# Altium schematic sheet SOM_POWER.SchDoc
size 420 x 297 mm; SheetNumber: 7; SheetTotal: 19
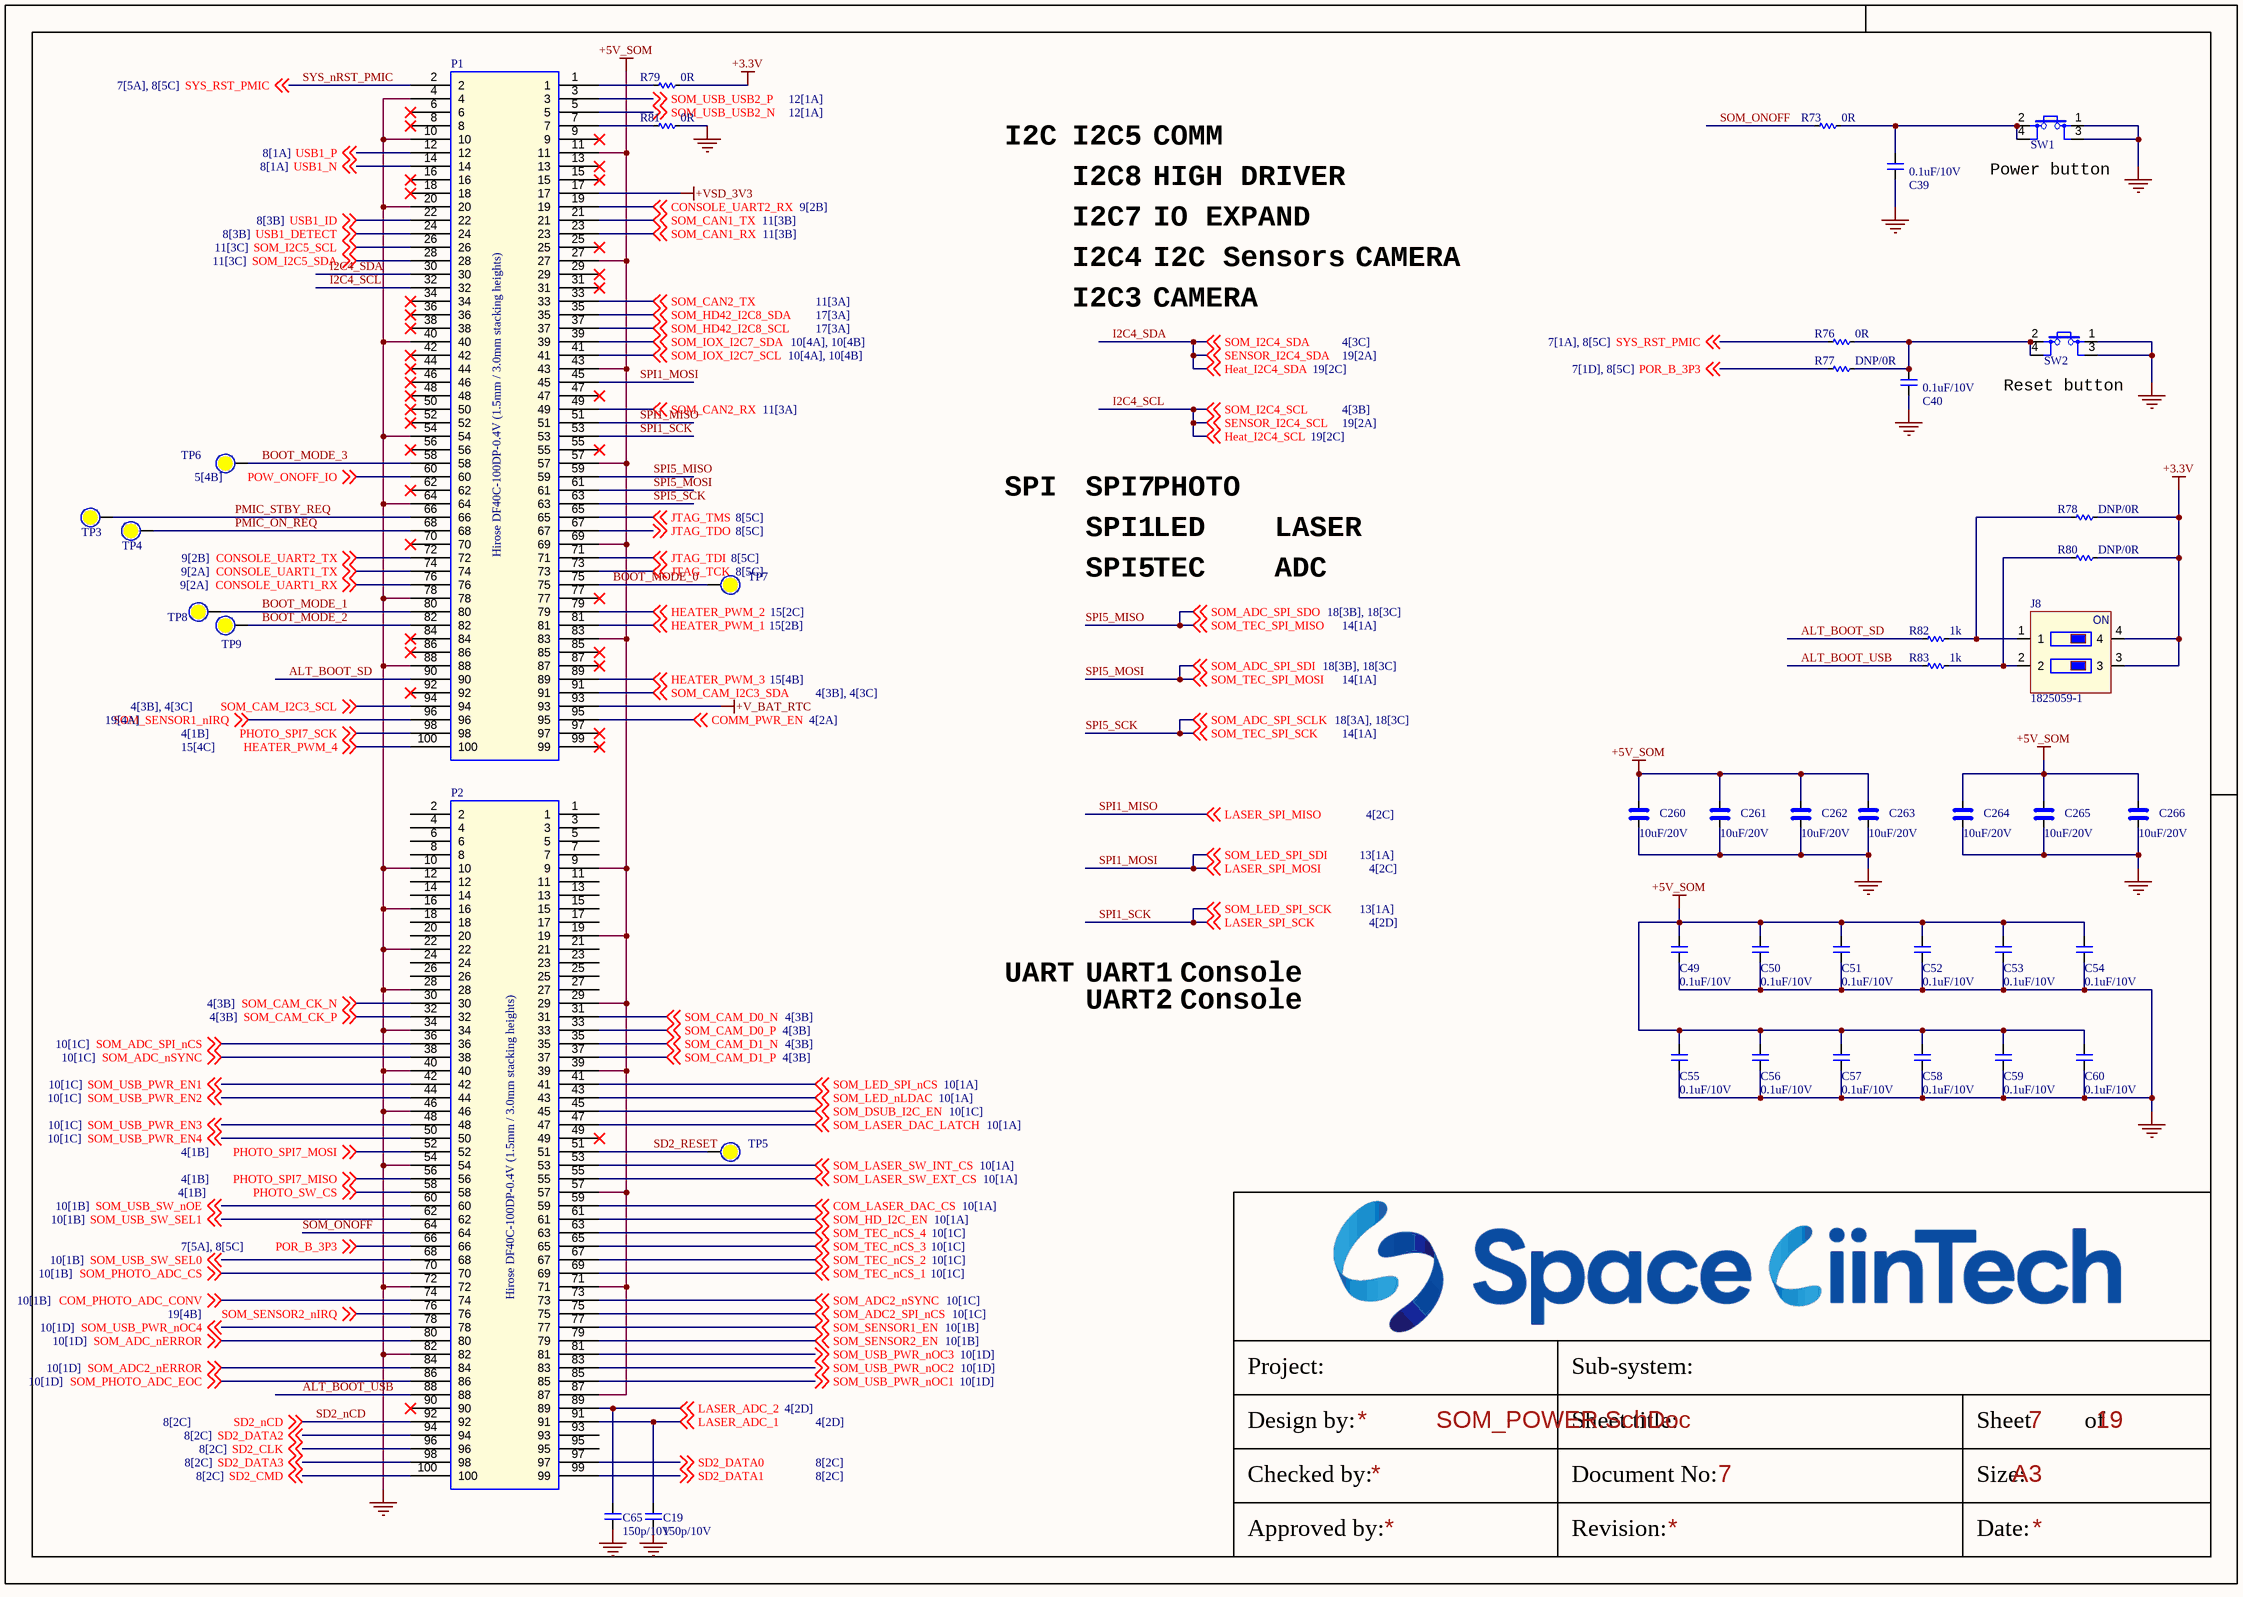
[diagram p0: SOM_POWER.SchDoc]

## Parts
C19  150p/10V  [CAP_C_1005X60]
C39  0.1uF/10V  [CAP_C_1005X60]
C40  0.1uF/10V  [CAP_C_1005X60]
C49  0.1uF/10V  [CAP_C_1005X60]
C50  0.1uF/10V  [CAP_C_1005X60]
C51  0.1uF/10V  [CAP_C_1005X60]
C52  0.1uF/10V  [CAP_C_1005X60]
C53  0.1uF/10V  [CAP_C_1005X60]
C54  0.1uF/10V  [CAP_C_1005X60]
C55  0.1uF/10V  [CAP_C_1005X60]
C56  0.1uF/10V  [CAP_C_1005X60]
C57  0.1uF/10V  [CAP_C_1005X60]
C58  0.1uF/10V  [CAP_C_1005X60]
C59  0.1uF/10V  [CAP_C_1005X60]
C60  0.1uF/10V  [CAP_C_1005X60]
C65  150p/10V  [CAP_C_1005X60]
C260  10uF/20V  [CAP_C_2012X110]
C261  10uF/20V  [CAP_C_2012X110]
C262  10uF/20V  [CAP_C_2012X110]
C263  10uF/20V  [CAP_C_2012X110]
C264  10uF/20V  [CAP_C_2012X110]
C265  10uF/20V  [CAP_C_2012X110]
C266  10uF/20V  [CAP_C_2012X110]
J8  1825059-1  [SW_1825059-1]
P1  Hirose DF40C-100DP-0.4V (1.5mm / 3.0mm stacking heights)  [B2B04M2X50R]
P2  Hirose DF40C-100DP-0.4V (1.5mm / 3.0mm stacking heights)  [B2B04M2X50R]
R73  0R  [RES_C_1005X40]
R76  0R  [RES_C_1005X40]
R77  DNP/0R  [RES_C_1005X40]
R78  DNP/0R  [RES_C_1005X40]
R79  0R  [RES_C_1005X40]
R80  DNP/0R  [RES_C_1005X40]
R81  0R  [RES_C_1005X40]
R82  1k  [RES_C_1005X40]
R83  1k  [RES_C_1005X40]
SW1  PushB  [TACTSW6x6SM]  (value not drawn)
SW2  PushB  [TACTSW6x6SM]  (value not drawn)
TP3  (no value)  [Testpoint_TH_D130H80]  (no BOM)
TP4  (no value)  [Testpoint_TH_D130H80]  (no BOM)
TP5  (no value)  [Testpoint_TH_D130H80]  (no BOM)
TP6  (no value)  [Testpoint_TH_D130H80]  (no BOM)
TP7  (no value)  [Testpoint_TH_D130H80]  (no BOM)
TP8  (no value)  [Testpoint_TH_D130H80]  (no BOM)
TP9  (no value)  [Testpoint_TH_D130H80]  (no BOM)

## Nets
+3.3V: J8.3 J8.4 R78.1 R79.1 R80.1
+5V_SOM: C49.2 C50.2 C51.2 C52.2 C53.2 C54.2 C55.2 C56.2 C57.2 C58.2 C59.2 C60.2 C260.1 C261.1 C262.1 C263.1 C264.1 C265.1 C266.1 P1.11 P1.27 P1.43 P1.57 P1.69 P1.83 P2.9 P2.19 P2.29 P2.39 P2.57 P2.71 P2.87
+V_BAT_RTC: P1.93
+VSD_3V3: P1.17
GND: C19.2 C39.1 C40.1 C49.1 C50.1 C51.1 C52.1 C53.1 C54.1 C55.1 C56.1 C57.1 C58.1 C59.1 C60.1 C65.2 C260.2 C261.2 C262.2 C263.2 C264.2 C265.2 C266.2 P1.4 P1.10 P1.20 P1.40 P1.54 P1.64 P1.78 P1.88 P2.10 P2.16 P2.22 P2.28 P2.34 P2.40 P2.46 P2.54 P2.72 P2.82 R81.1 SW1.1 SW1.3 SW2.1 SW2.3
ALT_BOOT_SD: P1.90 R82.2
ALT_BOOT_USB: P2.88 R83.2
BOOT_MODE_0: P1.75 TP7.0
BOOT_MODE_1: P1.80 TP8.0
BOOT_MODE_2: P1.82 TP9.0
BOOT_MODE_3: P1.58 TP6.0
COM_LASER_DAC_CS: P2.59 ; off-sheet COM_LASER_DAC_CS
COM_PHOTO_ADC_CONV: P2.74 ; off-sheet COM_PHOTO_ADC_CONV
COMM_PWR_EN: P1.95 ; off-sheet COMM_PWR_EN
CONSOLE_UART1_RX: P1.76 ; off-sheet CONSOLE_UART1_RX
CONSOLE_UART1_TX: P1.74 ; off-sheet CONSOLE_UART1_TX
CONSOLE_UART2_RX: P1.19 ; off-sheet CONSOLE_UART2_RX
CONSOLE_UART2_TX: P1.72 ; off-sheet CONSOLE_UART2_TX
HEATER_PWM_1: P1.81 ; off-sheet HEATER_PWM_1
HEATER_PWM_2: P1.79 ; off-sheet HEATER_PWM_2
HEATER_PWM_3: P1.89 ; off-sheet HEATER_PWM_3
HEATER_PWM_4: P1.100 ; off-sheet HEATER_PWM_4
I2C4_SCL: P1.32 ; off-sheet SOM_I2C4_SCL, off-sheet SENSOR_I2C4_SCL, off-sheet Heat_I2C4_SCL  [also labelled Heat_I2C4_SCL, SENSOR_I2C4_SCL, SOM_I2C4_SCL]
I2C4_SDA: P1.30 ; off-sheet SOM_I2C4_SDA, off-sheet SENSOR_I2C4_SDA, off-sheet Heat_I2C4_SDA  [also labelled Heat_I2C4_SDA, SENSOR_I2C4_SDA, SOM_I2C4_SDA]
JTAG_TCK: P1.73 ; off-sheet JTAG_TCK
JTAG_TDI: P1.71 ; off-sheet JTAG_TDI
JTAG_TDO: P1.67 ; off-sheet JTAG_TDO
JTAG_TMS: P1.65 ; off-sheet JTAG_TMS
LASER_ADC_1: C19.1 P2.91 ; off-sheet LASER_ADC_1
LASER_ADC_2: C65.1 P2.89 ; off-sheet LASER_ADC_2
PHOTO_SPI7_MISO: P2.56 ; off-sheet PHOTO_SPI7_MISO
PHOTO_SPI7_MOSI: P2.52 ; off-sheet PHOTO_SPI7_MOSI
PHOTO_SPI7_SCK: P1.98 ; off-sheet PHOTO_SPI7_SCK
PHOTO_SW_CS: P2.58 ; off-sheet PHOTO_SW_CS
PMIC_ON_REQ: P1.68 TP4.0
PMIC_STBY_REQ: P1.66 TP3.0
POR_B_3P3: P2.66 R77.2 ; off-sheet POR_B_3P3
POW_ONOFF_IO: P1.60 ; off-sheet POW_ONOFF_IO
SD2_CLK: P2.96 ; off-sheet SD2_CLK
SD2_CMD: P2.100 ; off-sheet SD2_CMD
SD2_DATA0: P2.97 ; off-sheet SD2_DATA0
SD2_DATA1: P2.99 ; off-sheet SD2_DATA1
SD2_DATA2: P2.94 ; off-sheet SD2_DATA2
SD2_DATA3: P2.98 ; off-sheet SD2_DATA3
SD2_nCD: P2.92 ; off-sheet SD2_nCD
SD2_RESET: P2.51 TP5.0
SOM_ADC2_nERROR: P2.84 ; off-sheet SOM_ADC2_nERROR
SOM_ADC2_nSYNC: P2.73 ; off-sheet SOM_ADC2_nSYNC
SOM_ADC2_SPI_nCS: P2.75 ; off-sheet SOM_ADC2_SPI_nCS
SOM_ADC_nERROR: P2.80 ; off-sheet SOM_ADC_nERROR
SOM_ADC_nSYNC: P2.38 ; off-sheet SOM_ADC_nSYNC
SOM_ADC_SPI_nCS: P2.36 ; off-sheet SOM_ADC_SPI_nCS
SOM_CAM_CK_N: P2.30 ; off-sheet SOM_CAM_CK_N
SOM_CAM_CK_P: P2.32 ; off-sheet SOM_CAM_CK_P
SOM_CAM_D0_N: P2.31 ; off-sheet SOM_CAM_D0_N
SOM_CAM_D0_P: P2.33 ; off-sheet SOM_CAM_D0_P
SOM_CAM_D1_N: P2.35 ; off-sheet SOM_CAM_D1_N
SOM_CAM_D1_P: P2.37 ; off-sheet SOM_CAM_D1_P
SOM_CAM_I2C3_SCL: P1.94 ; off-sheet SOM_CAM_I2C3_SCL
SOM_CAM_I2C3_SDA: P1.91 ; off-sheet SOM_CAM_I2C3_SDA
SOM_CAN1_RX: P1.23 ; off-sheet SOM_CAN1_RX
SOM_CAN1_TX: P1.21 ; off-sheet SOM_CAN1_TX
SOM_CAN2_RX: P1.49 ; off-sheet SOM_CAN2_RX
SOM_CAN2_TX: P1.33 ; off-sheet SOM_CAN2_TX
SOM_DSUB_I2C_EN: P2.45 ; off-sheet SOM_DSUB_I2C_EN
SOM_HD42_I2C8_SCL: P1.37 ; off-sheet SOM_HD42_I2C8_SCL
SOM_HD42_I2C8_SDA: P1.35 ; off-sheet SOM_HD42_I2C8_SDA
SOM_HD_I2C_EN: P2.61 ; off-sheet SOM_HD_I2C_EN
SOM_I2C5_SCL: P1.26 ; off-sheet SOM_I2C5_SCL
SOM_I2C5_SDA: P1.28 ; off-sheet SOM_I2C5_SDA
SOM_IOX_I2C7_SCL: P1.41 ; off-sheet SOM_IOX_I2C7_SCL
SOM_IOX_I2C7_SDA: P1.39 ; off-sheet SOM_IOX_I2C7_SDA
SOM_LASER_DAC_LATCH: P2.47 ; off-sheet SOM_LASER_DAC_LATCH
SOM_LASER_SW_EXT_CS: P2.55 ; off-sheet SOM_LASER_SW_EXT_CS
SOM_LASER_SW_INT_CS: P2.53 ; off-sheet SOM_LASER_SW_INT_CS
SOM_LED_nLDAC: P2.43 ; off-sheet SOM_LED_nLDAC
SOM_LED_SPI_nCS: P2.41 ; off-sheet SOM_LED_SPI_nCS
SOM_ONOFF: P2.64 R73.2
SOM_PHOTO_ADC_CS: P2.70 ; off-sheet SOM_PHOTO_ADC_CS
SOM_PHOTO_ADC_EOC: P2.86 ; off-sheet SOM_PHOTO_ADC_EOC
SOM_SENSOR1_EN: P2.77 ; off-sheet SOM_SENSOR1_EN
SOM_SENSOR1_nIRQ: P1.96 ; off-sheet SOM_SENSOR1_nIRQ
SOM_SENSOR2_EN: P2.79 ; off-sheet SOM_SENSOR2_EN
SOM_SENSOR2_nIRQ: P2.76 ; off-sheet SOM_SENSOR2_nIRQ
SOM_TEC_nCS_1: P2.69 ; off-sheet SOM_TEC_nCS_1
SOM_TEC_nCS_2: P2.67 ; off-sheet SOM_TEC_nCS_2
SOM_TEC_nCS_3: P2.65 ; off-sheet SOM_TEC_nCS_3
SOM_TEC_nCS_4: P2.63 ; off-sheet SOM_TEC_nCS_4
SOM_USB_PWR_EN1: P2.42 ; off-sheet SOM_USB_PWR_EN1
SOM_USB_PWR_EN2: P2.44 ; off-sheet SOM_USB_PWR_EN2
SOM_USB_PWR_EN3: P2.48 ; off-sheet SOM_USB_PWR_EN3
SOM_USB_PWR_EN4: P2.50 ; off-sheet SOM_USB_PWR_EN4
SOM_USB_PWR_nOC1: P2.85 ; off-sheet SOM_USB_PWR_nOC1
SOM_USB_PWR_nOC2: P2.83 ; off-sheet SOM_USB_PWR_nOC2
SOM_USB_PWR_nOC3: P2.81 ; off-sheet SOM_USB_PWR_nOC3
SOM_USB_PWR_nOC4: P2.78 ; off-sheet SOM_USB_PWR_nOC4
SOM_USB_SW_nOE: P2.60 ; off-sheet SOM_USB_SW_nOE
SOM_USB_SW_SEL0: P2.68 ; off-sheet SOM_USB_SW_SEL0
SOM_USB_SW_SEL1: P2.62 ; off-sheet SOM_USB_SW_SEL1
SOM_USB_USB2_N: P1.5 ; off-sheet SOM_USB_USB2_N
SOM_USB_USB2_P: P1.3 ; off-sheet SOM_USB_USB2_P
SPI1_MISO: P1.51 ; off-sheet LASER_SPI_MISO  [also labelled LASER_SPI_MISO]
SPI1_MOSI: P1.45 ; off-sheet LASER_SPI_MOSI, off-sheet SOM_LED_SPI_SDI  [also labelled LASER_SPI_MOSI, SOM_LED_SPI_SDI]
SPI1_SCK: P1.53 ; off-sheet LASER_SPI_SCK, off-sheet SOM_LED_SPI_SCK  [also labelled LASER_SPI_SCK, SOM_LED_SPI_SCK]
SPI5_MISO: P1.59 ; off-sheet SOM_ADC_SPI_SDO, off-sheet SOM_TEC_SPI_MISO  [also labelled SOM_ADC_SPI_SDO, SOM_TEC_SPI_MISO]
SPI5_MOSI: P1.61 ; off-sheet SOM_TEC_SPI_MOSI, off-sheet SOM_ADC_SPI_SDI  [also labelled SOM_ADC_SPI_SDI, SOM_TEC_SPI_MOSI]
SPI5_SCK: P1.63 ; off-sheet SOM_TEC_SPI_SCK, off-sheet SOM_ADC_SPI_SCLK  [also labelled SOM_ADC_SPI_SCLK, SOM_TEC_SPI_SCK]
SYS_nRST_PMIC: P1.2 R76.2 ; off-sheet SYS_RST_PMIC  [also labelled SYS_RST_PMIC]
USB1_DETECT: P1.24 ; off-sheet USB1_DETECT
USB1_ID: P1.22 ; off-sheet USB1_ID
USB1_N: P1.14 ; off-sheet USB1_N
USB1_P: P1.12 ; off-sheet USB1_P
NetC39_2: C39.2 R73.1 SW1.2 SW1.4
NetC40_2: C40.2 R76.1 R77.1 SW2.2 SW2.4
NetJ8_1: J8.1 R78.2 R82.1
NetJ8_2: J8.2 R80.2 R83.1
NetP1_1: P1.1 R79.2
NetP1_7: P1.7 R81.2

Not connected (* = marked no-connect by the designer): P1 6* 8* 9* 13* 15* 16* 18* 25* 29* 31* 34* 36* 38* 42* 44* 46* 47* 48* 50* 52* 55* 56* 62* 70* 77* 84* 85* 86* 87* 92* 97* 99*; P2 1 2 3 4 5 6 7 8 11 12 13 14 15 17 18 20 21 23 24 25 26 27 49* 90* 93 95

## Notes on the sheet
- I2C
- I2C8
- I2C5
- HIGH DRIVER
- COMM
- (near SW1) Power button
- I2C7
- IO EXPAND
- I2C4
- I2C3
- I2C Sensors
- CAMERA
- (near SW2) Reset button
- SPI
- SPI7
- PHOTO
- SPI5
- SPI1
- LED
- TEC
- ADC
- LASER
- UART
- UART1
- Console
- UART2
- Project:
- Sub-system:
- Design by:
- Sheet title:
- Sheet
- of
- Checked by:
- Approved by:
- Revision:
- Document No:
- Size:
- Date:
- A3
- (in symbol DIP_SW_2x2) ON

## Library data of the parts
C19 C39 C40 C49-C60 C65 = _CAP_C_2: CAP CHIP
C260-C266 = _CAP_C_High_2: CAP CHIP High Value
J8 = DIP_SW_2x2
P1 = Hirose DF40C-100DP-0_0.4V: P/N: 182K10004S; PCB Footprint: B2B04M2X50P; CLABCONF0: =SB-UCMIMX93
P2 = Hirose DF40C-100DP-0_1.4V: P/N: 182K10004S; PCB Footprint: B2B04M2X50P; CLABCONF0: =SB-UCMIMX93
R73 R76-R83 = _RES_B_2: RES
SW1 SW2 = TACT SW 6x6mm SMT: P/N: 170B00001S; CLABCONF0: =SB-UCMIMX93; PCB Footprint: TACTSW6x6SM
TP3-TP9 = Test Point: Solder: NF